# EAGLE design power_board_final_revisions (EAGLE 5.10)

## Sheet 1 of 5
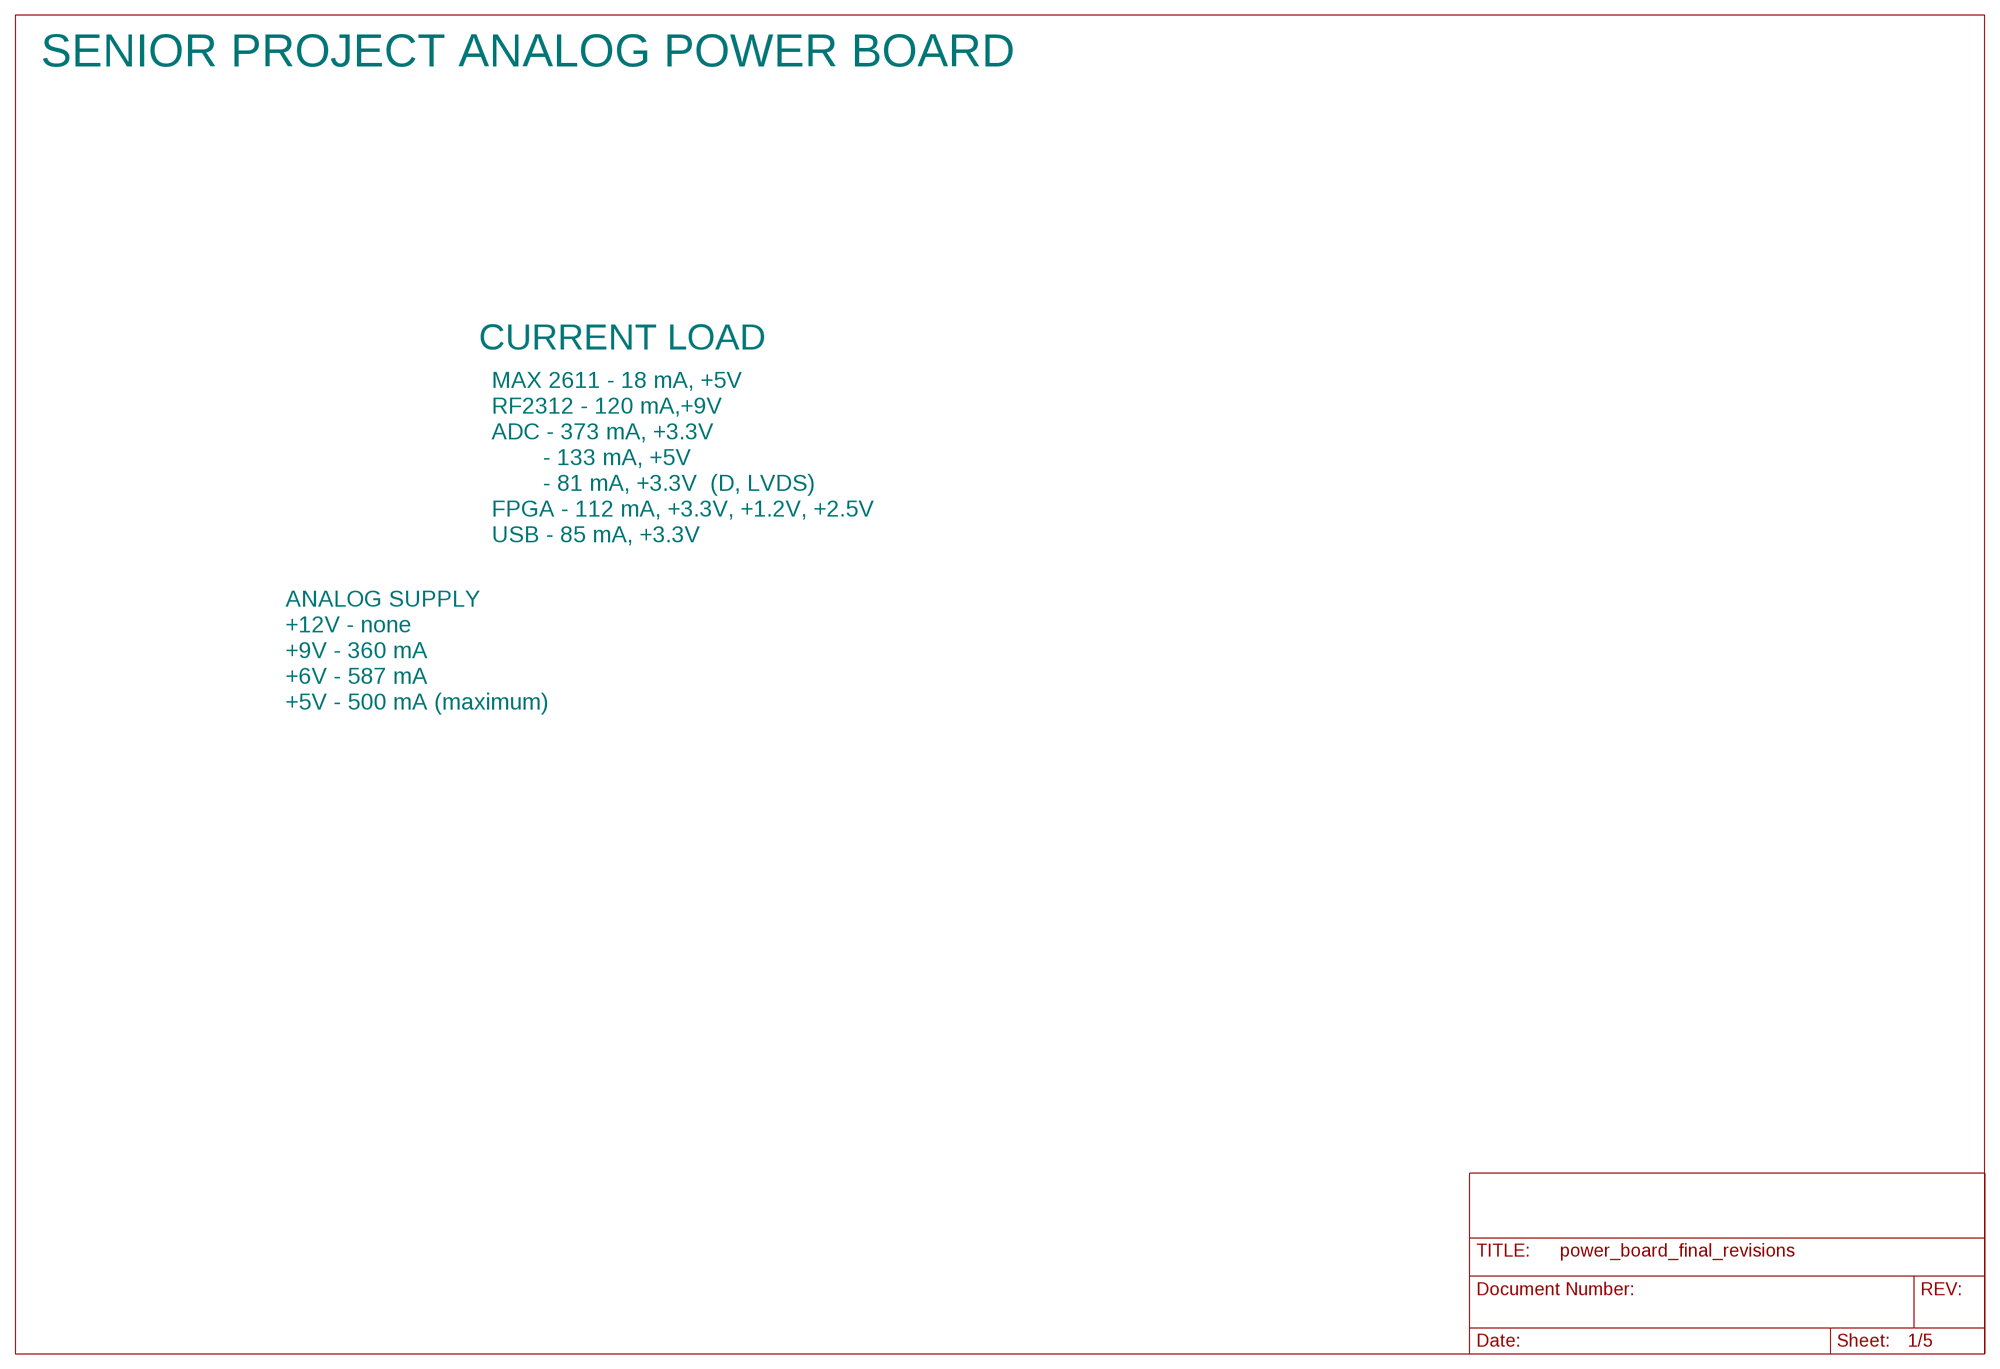
[diagram p0: schematic, sheet 1]

### Notes on the sheet
- SENIOR PROJECT ANALOG POWER BOARD
- CURRENT LOAD
- MAX 2611 - 18 mA, +5V
- RF2312 - 120 mA,+9V
- ADC - 373 mA, +3.3V
- - 133 mA, +5V
- - 81 mA, +3.3V  (D, LVDS)
- FPGA - 112 mA, +3.3V, +1.2V, +2.5V
- USB - 85 mA, +3.3V
- ANALOG SUPPLY
- +12V - none
- +9V - 360 mA
- +6V - 587 mA
- +5V - 500 mA (maximum)

## Sheet 2 of 5
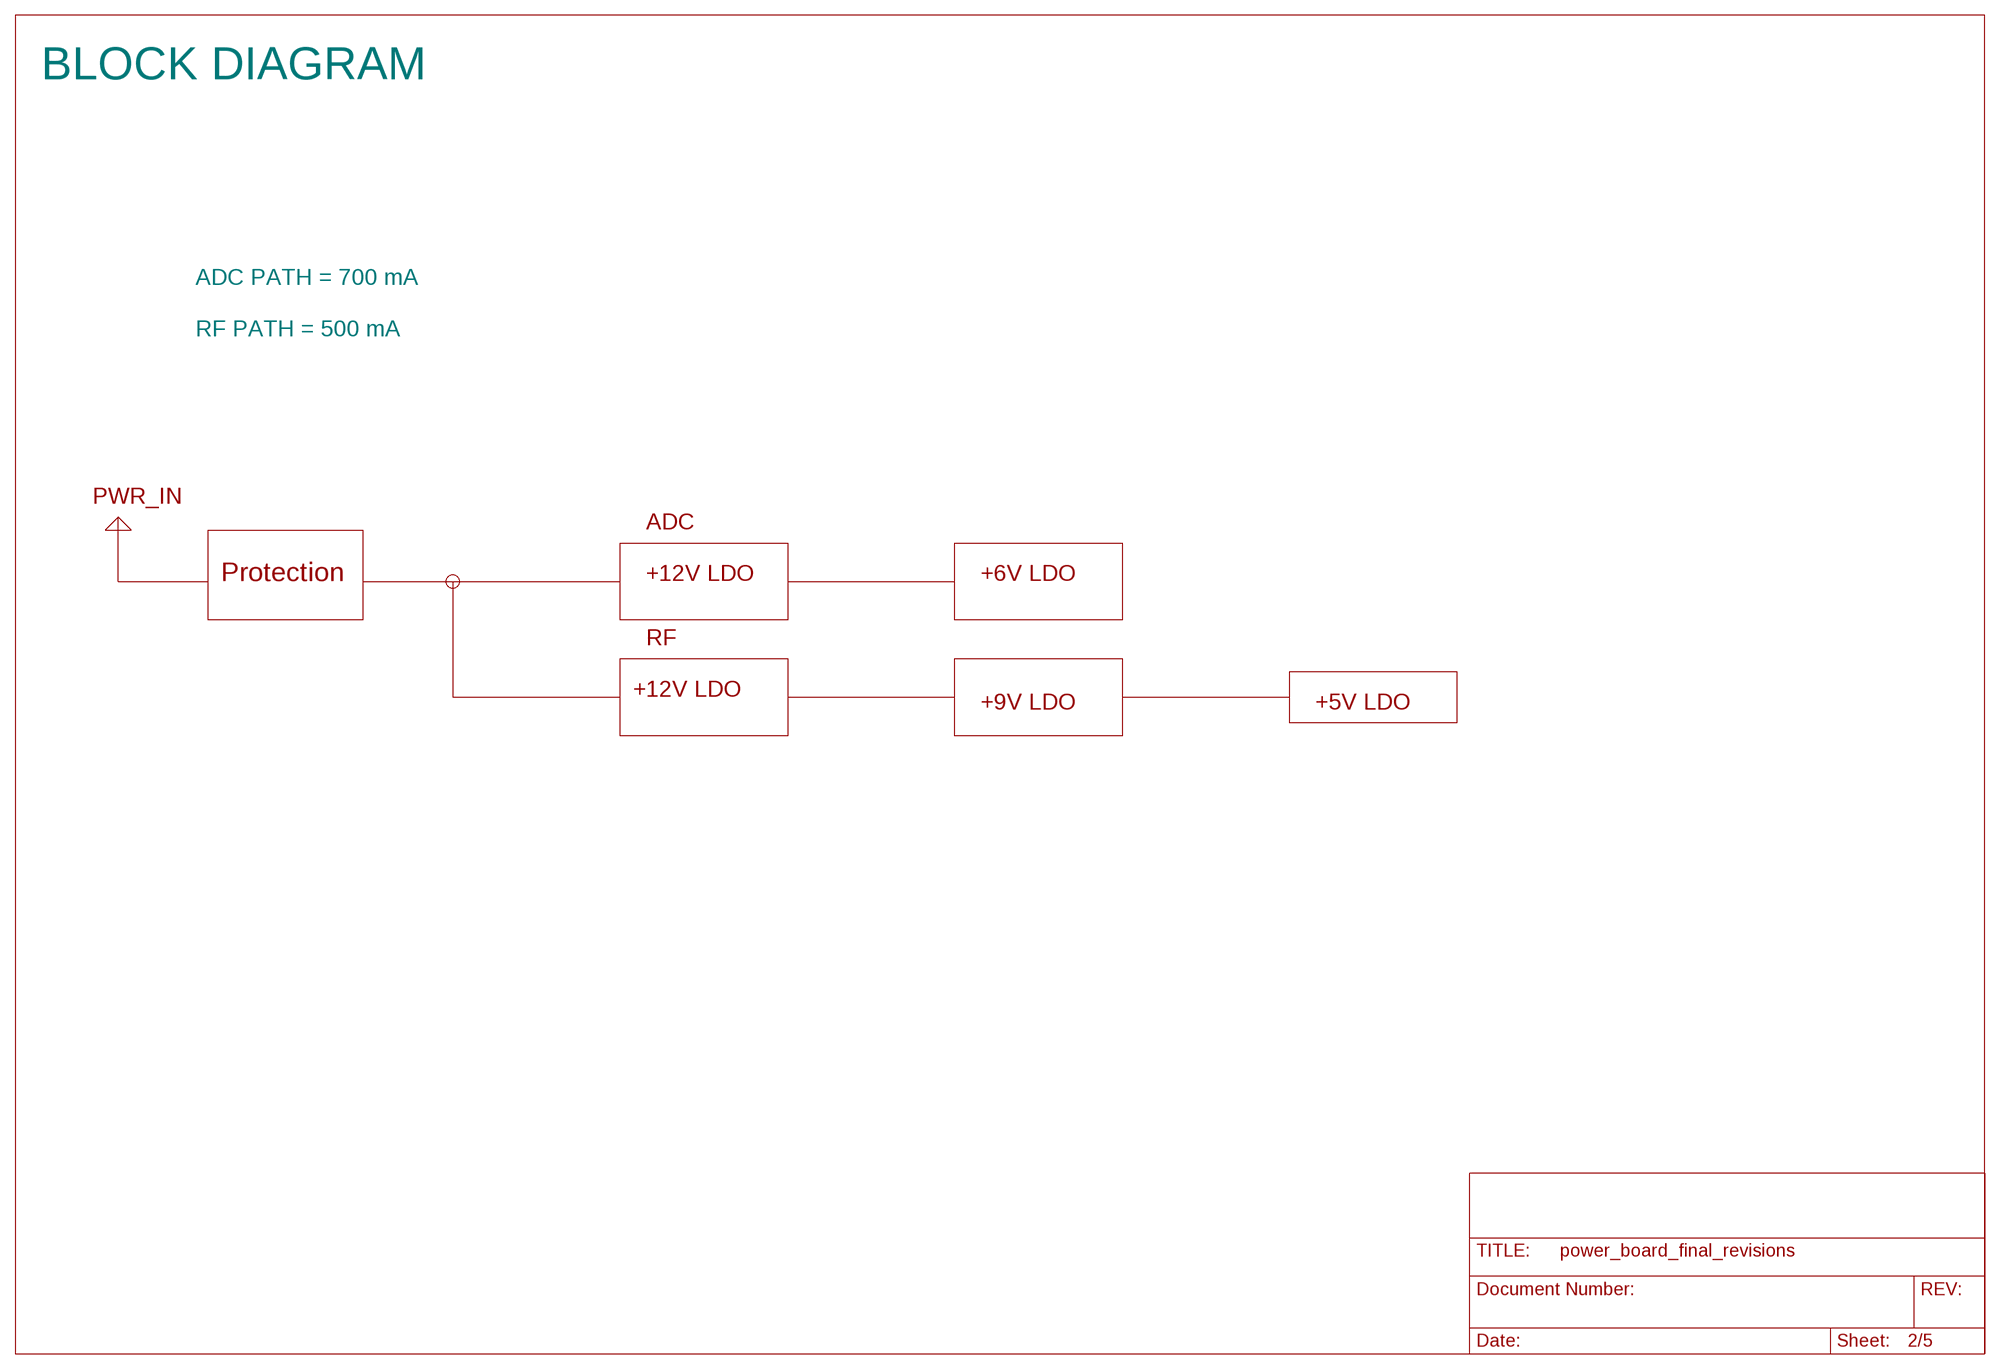
[diagram p1: schematic, sheet 2]

### Notes on the sheet
- BLOCK DIAGRAM
- ADC PATH = 700 mA
- RF PATH = 500 mA
- PWR_IN
- ADC
- Protection | +12V LDO | +6V LDO
- RF
- +12V LDO
- +9V LDO | +5V LDO

## Sheet 3 of 5
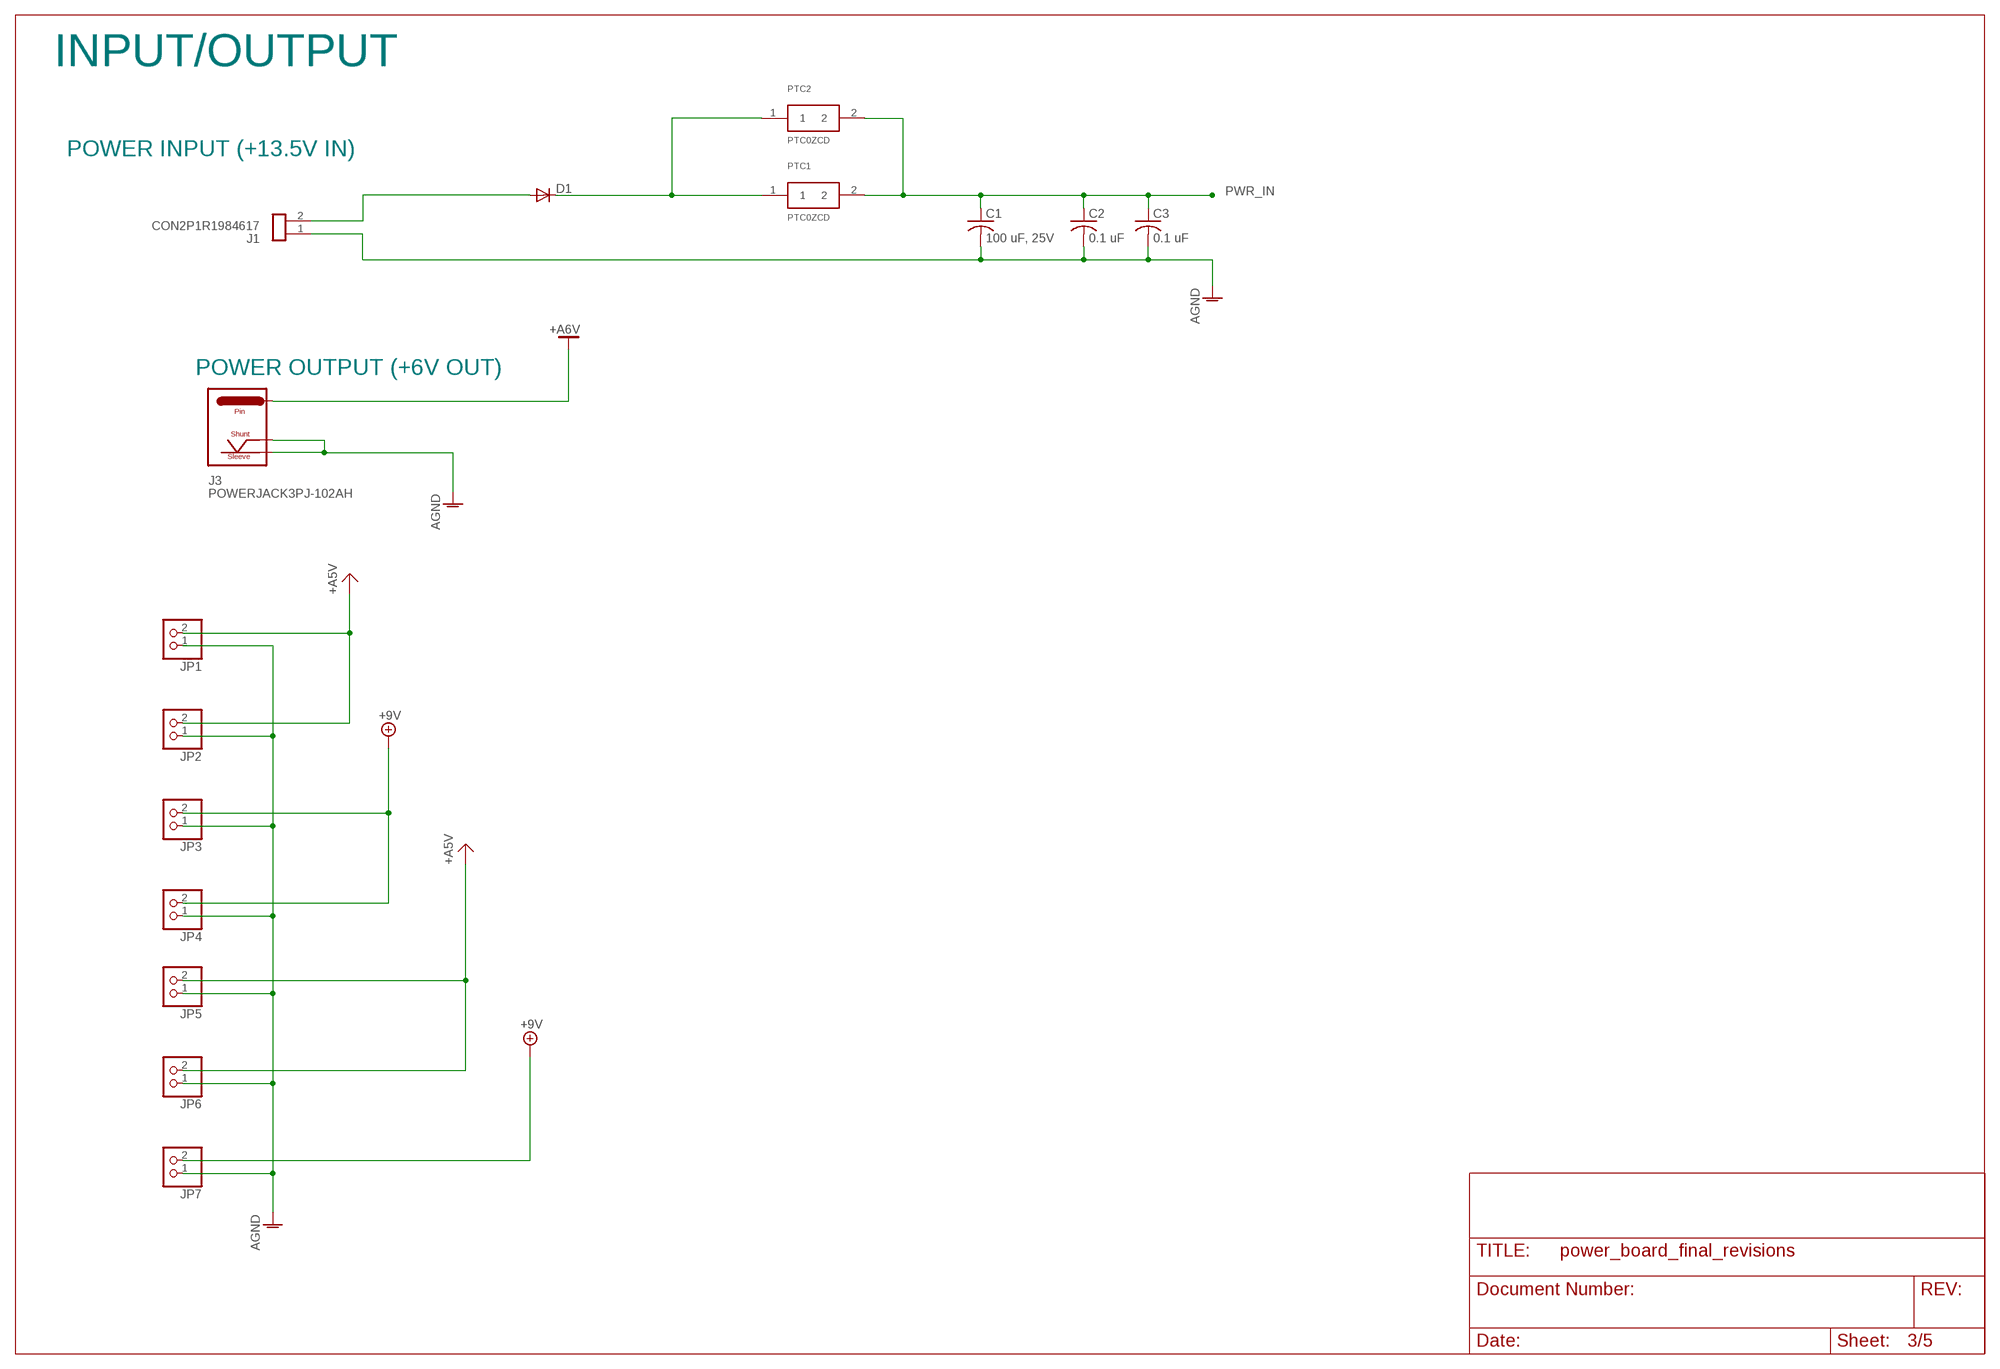
[diagram p2: schematic, sheet 3]

### Parts
C1  100 uF, 25V  C-USC1206  [C1206]
C2  0.1 uF  C-USC0805  [C0805]
C3  0.1 uF  C-USC0805  [C0805]
D1  1N4148DO35-7  [DO35-7]
J1  CON2P1R1984617  [1984617]
J3  POWERJACK3PJ-102AH  [PJ-102AH]
JP1  PINHD-1X2  [1X02]
JP2  PINHD-1X2  [1X02]
JP3  PINHD-1X2  [1X02]
JP4  PINHD-1X2  [1X02]
JP5  PINHD-1X2  [1X02]
JP6  PINHD-1X2  [1X02]
JP7  PINHD-1X2  [1X02]
PTC1  PTC0ZCD  [PTC-2920]
PTC2  PTC0ZCD  [PTC-2920]

### Nets
+9V: JP3.2 JP4.2 JP7.2 ; also sheet 4
+A5V: JP1.2 JP2.2 JP5.2 JP6.2 ; also sheet 4
+A6V: J3.CENTER(PIN) ; also sheet 5
AGND: C1.2 C2.2 C3.2 J1.1 J3.SLEEVE J3.SWITCH(SHUNT) JP1.1 JP2.1 JP3.1 JP4.1 JP5.1 JP6.1 JP7.1 ; also sheet 4,5
N$22: D1.C PTC1.1 PTC2.1
N$23: D1.A J1.2
PWR_IN: C1.1 C2.1 C3.1 PTC1.2 PTC2.2 ; also sheet 4,5

### Notes on the sheet
- INPUT/OUTPUT
- POWER INPUT (+13.5V IN)
- POWER OUTPUT (+6V OUT)

## Sheet 4 of 5
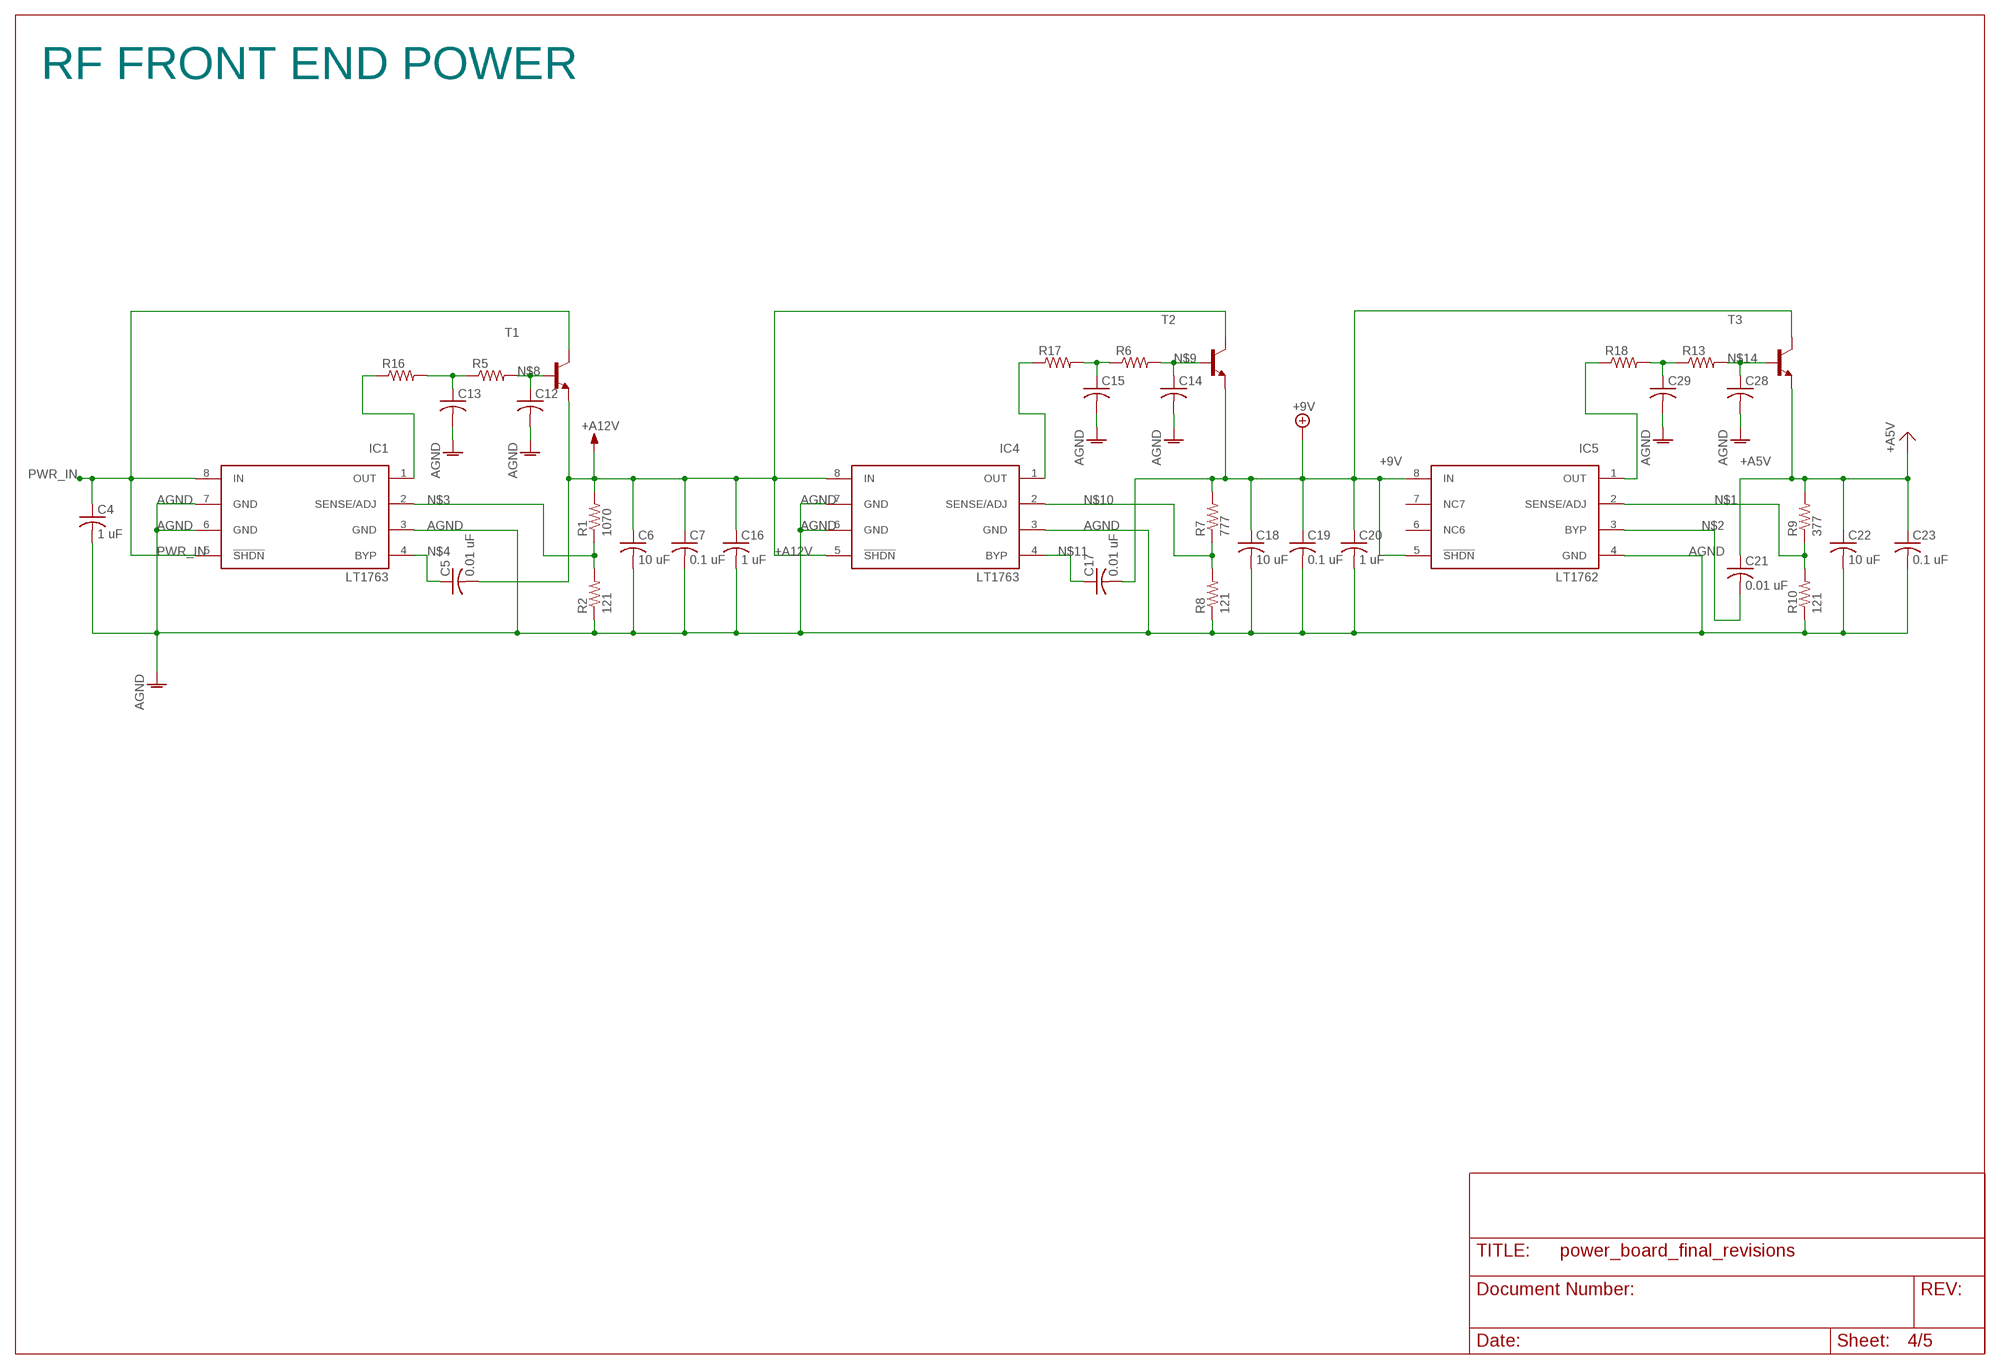
[diagram p3: schematic, sheet 4]

### Parts
C4  1 uF  C-USC0603  [C0603]
C5  0.01 uF  C-USC0603  [C0603]
C6  10 uF  C-USC0805  [C0805]
C7  0.1 uF  C-USC0805  [C0805]
C12  C-USC1206  [C1206]
C13  C-USC1206  [C1206]
C14  C-USC1206  [C1206]
C15  C-USC1206  [C1206]
C16  1 uF  C-USC0603  [C0603]
C17  0.01 uF  C-USC0603  [C0603]
C18  10 uF  C-USC0603  [C0603]
C19  0.1 uF  C-USC0805  [C0805]
C20  1 uF  C-USC0603  [C0603]
C21  0.01 uF  C-USC0603  [C0603]
C22  10 uF  C-USC0603  [C0603]
C23  0.1 uF  C-USC0805  [C0805]
C28  C-USC1206  [C1206]
C29  C-USC1206  [C1206]
IC1  LT1763  [SO-08]
IC4  LT1763  [SO-08]
IC5  LT1762  [MSOP08]
R1  1070  R-US_R0603  [R0603]
R2  121  R-US_R0603  [R0603]
R5  R-US_R0603  [R0603]
R6  R-US_R0603  [R0603]
R7  777  R-US_R0603  [R0603]
R8  121  R-US_R0603  [R0603]
R9  377  R-US_R0603  [R0603]
R10  121  R-US_R0603  [R0603]
R13  R-US_R0603  [R0603]
R16  R-US_R0603  [R0603]
R17  R-US_R0603  [R0603]
R18  R-US_R0603  [R0603]
T1  -NPN-SOT223  [SOT223]
T2  -NPN-SOT223  [SOT223]
T3  -NPN-SOT223  [SOT223]

### Nets
+9V: C17.2 C18.1 C19.1 C20.1 IC5.5(!SHDN) IC5.8(IN) R7.2 T2.3(E) T3.4(C) ; also sheet 3
+A5V: C21.1 C22.1 C23.1 R9.2 T3.3(E) ; also sheet 3
+A12V: C5.2 C6.1 C7.1 C16.1 IC4.5(!SHDN) IC4.8(IN) R1.2 T1.3(E) T2.4(C)
AGND: C4.2 C6.2 C7.2 C12.2 C13.2 C14.2 C15.2 C16.2 C18.2 C19.2 C20.2 C22.2 C23.2 C28.2 C29.2 IC1.3(GND) IC1.6(GND) IC1.7(GND) IC4.3(GND) IC4.6(GND) IC4.7(GND) IC5.4(GND) R2.1 R8.1 R10.1 ; also sheet 3,5
N$1: IC5.2(SENSE/ADJ) R9.1 R10.2
N$2: C21.2 IC5.3(BYP)
N$3: IC1.2(SENSE/ADJ) R1.1 R2.2
N$4: C5.1 IC1.4(BYP)
N$6: C13.1 R5.1 R16.2
N$8: C12.1 R5.2 T1.1(B)
N$9: C14.1 R6.2 T2.1(B)
N$10: IC4.2(SENSE/ADJ) R7.1 R8.2
N$11: C17.1 IC4.4(BYP)
N$12: C15.1 R6.1 R17.2
N$13: C29.1 R13.1 R18.2
N$14: C28.1 R13.2 T3.1(B)
N$19: IC5.1(OUT) R18.1
N$20: IC1.1(OUT) R16.1
N$21: IC4.1(OUT) R17.1
PWR_IN: C4.1 IC1.5(!SHDN) IC1.8(IN) T1.4(C) ; also sheet 3,5
Unconnected: IC5.6(NC6) IC5.7(NC7)

### Notes on the sheet
- RF FRONT END POWER

## Sheet 5 of 5
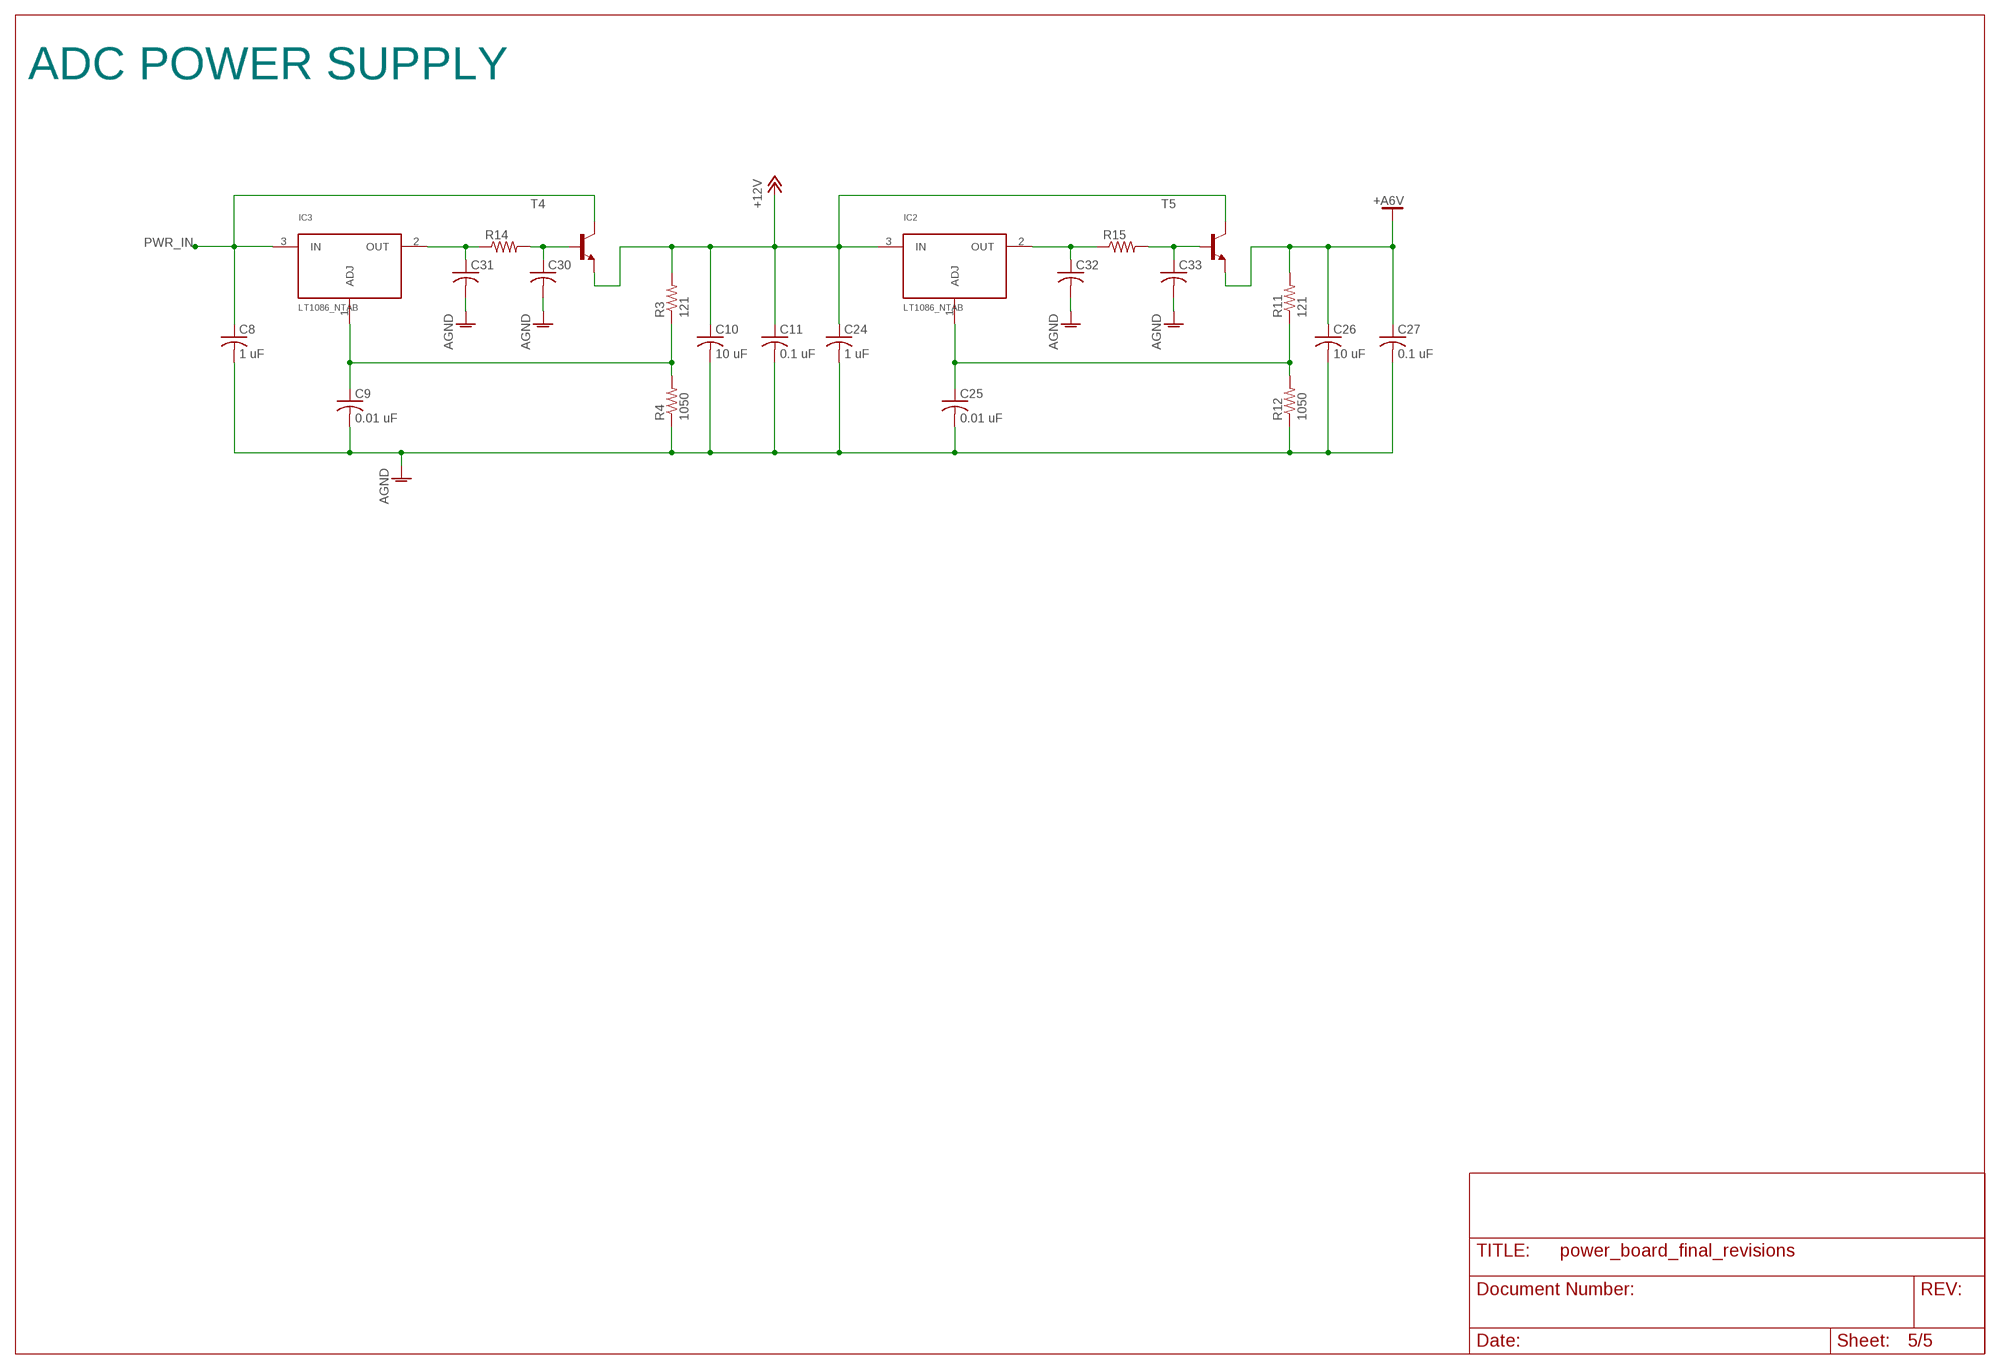
[diagram p4: schematic, sheet 5]

### Parts
C8  1 uF  C-USC0603  [C0603]
C9  0.01 uF  C-USC0603  [C0603]
C10  10 uF  C-USC0805  [C0805]
C11  0.1 uF  C-USC0603  [C0603]
C24  1 uF  C-USC0603  [C0603]
C25  0.01 uF  C-USC0603  [C0603]
C26  10 uF  C-USC0805  [C0805]
C27  0.1 uF  C-USC0603  [C0603]
C30  C-USC0805  [C0805]
C31  C-USC0805  [C0805]
C32  C-USC0805  [C0805]
C33  C-USC0805  [C0805]
IC2  LT1086_NTAB  LT1086_NTABV  [TO220V]
IC3  LT1086_NTAB  LT1086_NTABV  [TO220V]
R3  121  R-US_R0603  [R0603]
R4  1050  R-US_R0603  [R0603]
R11  121  R-US_R0603  [R0603]
R12  1050  R-US_R0603  [R0603]
R14  R-US_R0603  [R0603]
R15  R-US_R0603  [R0603]
T4  -NPN-SOT223  [SOT223]
T5  -NPN-SOT223  [SOT223]

### Nets
+12V: C10.1 C11.1 C24.1 IC2.3(IN) R3.2 T4.3(E) T5.4(C)
+A6V: C26.1 C27.1 R11.2 T5.3(E) ; also sheet 3
AGND: C8.2 C9.2 C10.2 C11.2 C24.2 C25.2 C26.2 C27.2 C30.2 C31.2 C32.2 C33.2 R4.1 R12.1 ; also sheet 3,4
N$5: C25.1 IC2.1(ADJ) R11.1 R12.2
N$7: C9.1 IC3.1(ADJ) R3.1 R4.2
N$15: C31.1 IC3.2(OUT) R14.1
N$16: C30.1 R14.2 T4.1(B)
N$17: C32.1 IC2.2(OUT) R15.1
N$18: C33.1 R15.2 T5.1(B)
PWR_IN: C8.1 IC3.3(IN) T4.4(C) ; also sheet 3,4

### Notes on the sheet
- ADC POWER SUPPLY

## Library data of the parts
C1-C29 = rcl:C-US: CAPACITOR, American symbol
C30-C33 = resistor:C-US: CAPACITOR, American symbol
D1 = diode:1N4148: DIODE high speed (Philips)
IC1 IC4 = senior_project_lib:LT1763
IC2 IC3 = senior_project_lib:LT1086_NTAB
IC5 = senior_project_lib:LT1762
J1 = ads4:CON2P1R: 2-Pin Single Row Header Strip
J3 = ads4:POWERJACK3: Pin-Sleeve-Shunt Power Jack
JP1-JP7 = pinhead:PINHD-1X2: PIN HEADER
PTC1 PTC2 = senior_project_lib:PTC
R1-R13 R16-R18 = rcl:R-US_: RESISTOR, American symbol
R14 R15 = resistor:R-US_: RESISTOR, American symbol
T1-T5 = transistor-neu-to92:*-NPN-: NPN Transistror

## Board
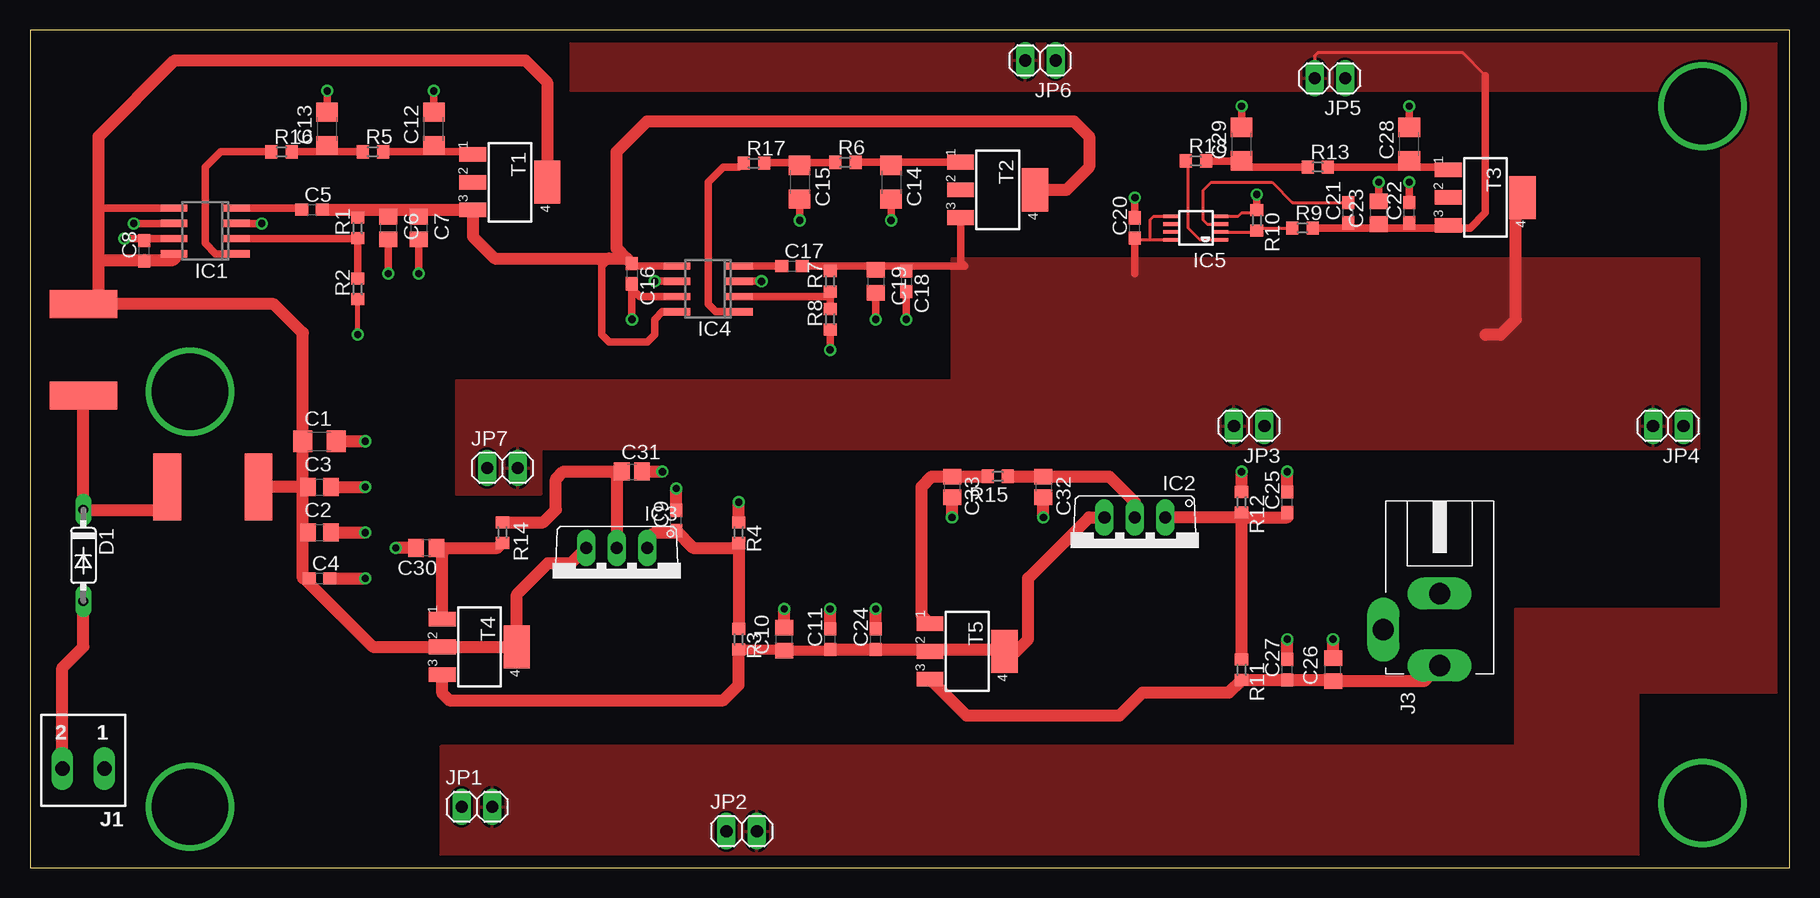
[diagram p5: board, top side]
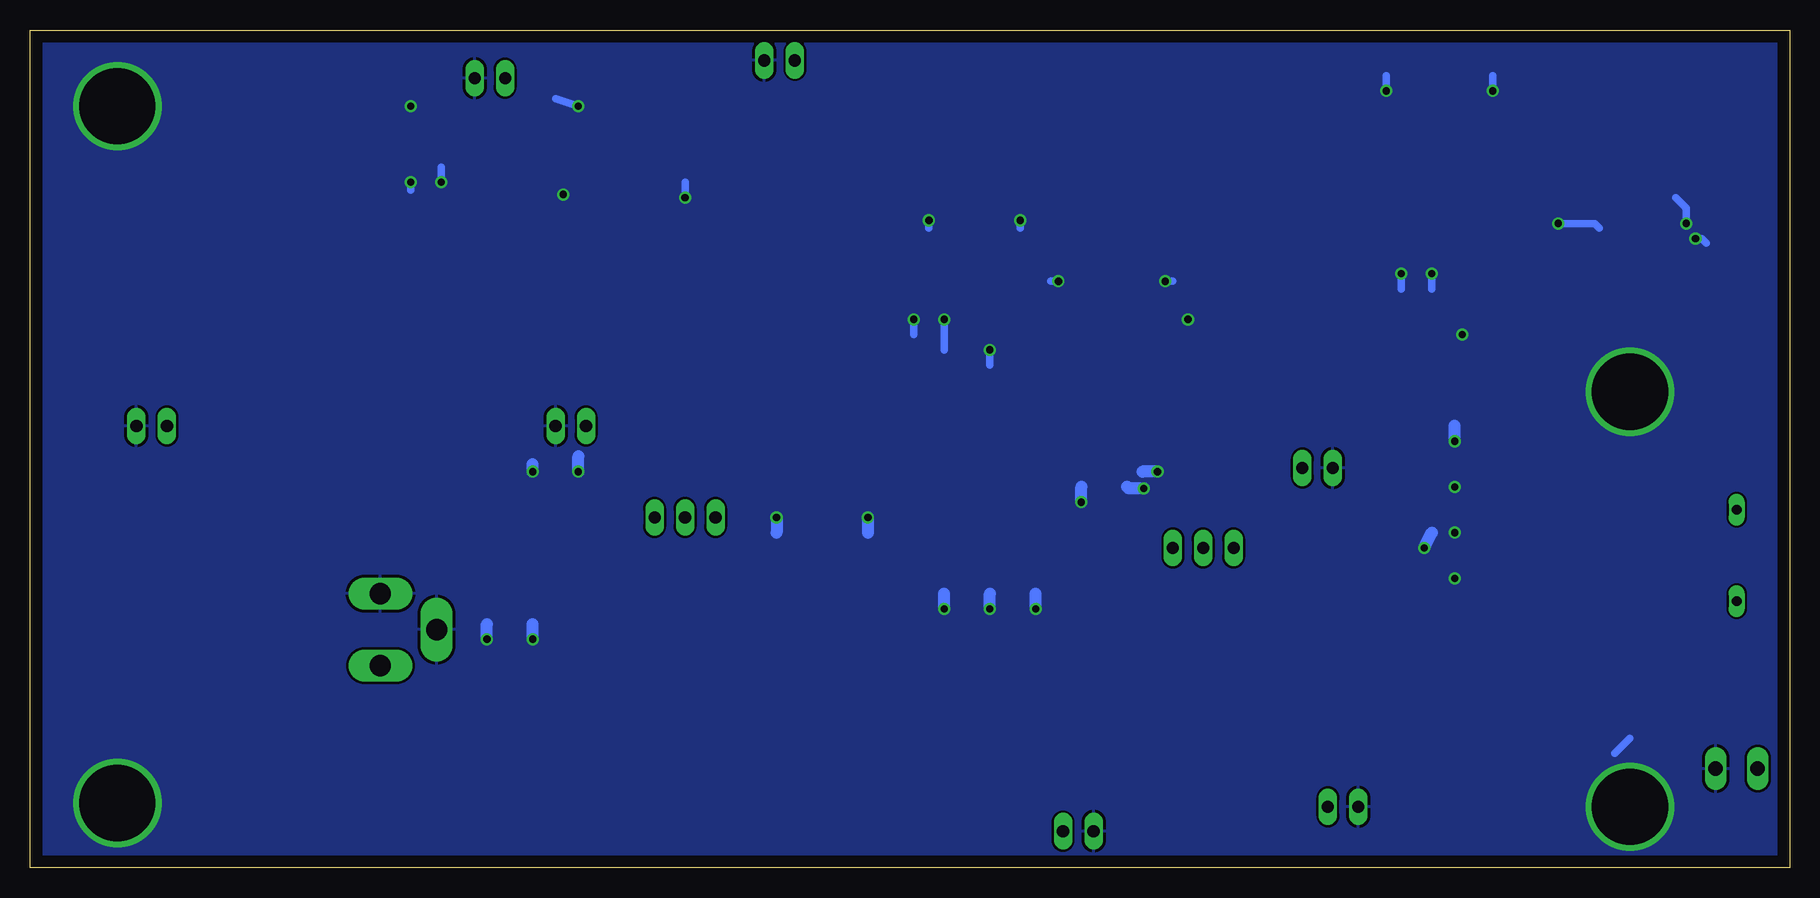
[diagram p6: board, bottom side, seen from below]

Size 146.66 x 69.85 mm. Coordinates in mm from the lower left corner, seen from the top.
Outline: 0,0 146.66,0 146.66,69.85 0,69.85 0,0
Copper layers (1*16): Top 0.035mm / dielectric 1.5mm / Bottom 0.035mm
Design rules "default": minimum track width 10mil, minimum drill 24mil, track to track 8mil, track to pad 8mil, pad to pad 8mil, via to via 8mil, smd to smd 8mil, copper to edge 40mil, drill to drill 8mil, minimum pad ring 10mil, minimum via ring 8mil, stop-mask expansion 4mil, vias tented up to drill 0mil, thermal gap 10mil

### Footprints (pad centres in the part's own frame; a part is rotated, then mirrored left to right if it is on the bottom)
C1206 = smd 1.6 x 1.8: 1 -1.4,0; 2 1.4,0
C0805 = smd 1.3 x 1.5: 1 -0.95,0; 2 0.95,0
C0603 = smd 1.1 x 1: 1 -0.85,0; 2 0.85,0
C0805' = smd 1.3 x 1.5: 1 -0.85,0; 2 0.85,0
DO35-7 = drill 0.813 long: A 3.81,0; C -3.81,0
SO-08 = smd 0.6 x 2.2: 1 -1.905,-2.6; 2 -0.635,-2.6; 3 0.635,-2.6; 4 1.905,-2.6; 5 1.905,2.6; 6 0.635,2.6; 7 -0.635,2.6; 8 -1.905,2.6
TO220V = drill 1.016 long: 1 -2.54,-2.54; 2 0,-2.54; 3 2.54,-2.54
MSOP08 = smd 0.3 x 1.2: 1 -0.976,-2.113; 2 -0.326,-2.113; 3 0.324,-2.113; 4 0.974,-2.113; 5 0.974,2.112; 6 0.324,2.112; 7 -0.326,2.112; 8 -0.976,2.112
1984617 = drill 1.2 long: 1 -1.75,0; 2 1.75,0
PJ-102AH = drill 1.778 long: CENTER -6,0; SLEEVE 0,0; SWITCH -3,4.7
1X02 = drill 1.016 long: 1 -1.27,0; 2 1.27,0
PTC-2920 = smd 2.311 x 5.613: 1 -3.81,0; 2 3.81,0
R0603 = smd 1 x 1.1: 1 -0.85,0; 2 0.85,0
SOT223 = smd 1.219 x 2.235: 1 -2.311,-3.099; 2 0,-3.099; 3 2.311,-3.099 | smd 3.6 x 2.2: 4 0,3.099

### Placement (x,y rotation side)
C1  24.13,35.56 0 top
C2  24.13,27.94 0 top
C3  24.13,31.75 0 top
C4  24.13,24.13 0 top
C5  23.49,54.86 0 top
C6  29.84,53.34 270 top
C7  32.38,53.34 270 top
C8  9.52,51.44 90 top
C9  53.85,28.96 90 top
C10  62.86,19.05 90 top
C11  66.67,19.05 90 top
C12  33.66,61.59 90 top
C13  24.77,61.59 90 top
C14  71.75,57.15 270 top
C15  64.14,57.15 270 top
C16  50.17,49.53 270 top
C17  63.5,50.16 0 top
C18  73.03,48.9 270 top
C19  70.48,48.9 270 top
C20  92.08,53.34 90 top
C21  109.86,54.61 90 top
C22  114.94,54.61 90 top
C23  112.4,54.61 90 top
C24  70.48,19.05 90 top
C25  104.78,30.48 90 top
C26  108.58,16.51 90 top
C27  104.78,16.51 90 top
C28  114.94,60.33 90 top
C29  100.97,60.33 90 top
C30  [C0805']  33.02,26.67 180 top
C31  [C0805']  50.17,33.02 0 top
C32  [C0805']  84.45,31.75 270 top
C33  [C0805']  76.83,31.75 270 top
D1  4.45,26.04 270 top
IC1  14.61,53.09 90 top
IC2  92.08,26.67 180 top
IC3  48.89,24.13 180 top
IC4  56.52,48.26 90 top
IC5  97.16,53.34 90 top
J1  4.45,8.26 180 top
J3  117.47,22.86 90 top
JP1  37.25,5.08 0 top
JP2  59.31,3.05 0 top
JP3  101.6,36.83 180 top
JP4  136.53,36.83 180 top
JP5  108.33,65.83 180 top
JP6  84.2,67.31 180 top
JP7  39.37,33.34 0 top
PTC1  15.24,31.75 0 top
PTC2  4.45,43.18 90 top
R1  27.3,53.34 90 top
R2  27.3,48.26 90 top
R3  59.06,19.05 270 top
R4  59.06,27.94 270 top
R5  28.58,59.69 0 top
R6  67.94,58.8 0 top
R7  66.67,48.9 90 top
R8  66.67,45.72 90 top
R9  106.05,53.34 0 top
R10  102.23,53.98 270 top
R11  100.97,16.51 270 top
R12  100.97,30.48 270 top
R13  107.31,58.42 0 top
R14  39.37,27.94 270 top
R15  80.64,32.64 180 top
R16  20.95,59.69 0 top
R17  60.33,58.74 0 top
R18  97.16,58.93 0 top
T1  40.01,57.15 270 top
T2  80.64,56.52 270 top
T3  121.28,55.88 270 top
T4  37.47,18.41 270 top
T5  78.11,18.03 270 top

### Tracks (layer width: path | path; a pad name or v marks a point on that pad's centre or on a via)
+9V
  Top 0.254: 93.34,52.36 92.2,52.36 C20.1 | 93.34,52.36 IC5.8 | IC5.5 93.64,54.31 93.34,54.02 93.34,52.36
  Top 0.61: C17.2 66.67,50.16 | 66.67,50.16 70.48,50.16 | 70.48,50.16 73.03,50.16 | 73.03,50.16 77.89,50.16 77.55,50.51 T2.3 | 66.67,50.16 R7.2 | 70.48,50.16 C19.1 | 73.03,50.16 C18.1 | 92.08,49.53 C20.1
  Top 1.016: T3.4 123.82,55.32 123.82,45.72 122.56,44.45 121.28,44.45
  pour Top: 76.83,50.8 139.06,50.8 139.06,34.92 42.55,34.92 42.55,31.11 35.56,31.11 35.56,40.64 76.83,40.64
+12V
  Top 0.813: C11.1 66.58,18.1 C10.1 62.77,18.2 R3.2
  Top 1.016: T4.3 34.37,14.53 34.92,13.97 57.78,13.97 59.06,15.24 R3.2 | C11.1 C24.1 81.75,18.2 81.92,18.03 | 81.92,18.03 T5.4 | 81.92,18.03 82.17,18.03 83.19,19.05 83.19,24.13 88.27,29.21 IC2.3
+A5V
  Top 0.254: 109.86,53.34 C21.1 | 112.4,53.34 C23.1 | JP5.2 107.06,67.69 107.31,67.94 119.38,67.94 121.28,66.04
  Top 0.61: T3.3 117.7,53.57 117.47,53.34 115.35,53.34 C22.1 114.94,53.34 112.4,53.34 109.86,53.34 R9.2 120.01,53.34 121.28,54.61 121.28,66.04
  pour Top: 45.09,72.39 146.69,72.39 146.69,16.51 146.69,14.61 133.99,14.61 133.99,0 34.29,0 34.29,10.16 123.82,10.16 123.82,21.59 140.97,21.59 140.97,64.77 45.09,64.77
+A6V
  Top 0.813: 108.48,15.66 C26.1 | 116.18,15.56 116.28,15.66
  Top 1.016: T5.3 78.03,12.7 90.81,12.7 92.71,14.61 99.91,14.61 R11.2 C27.1 108.48,15.66 | 116.28,15.66 J3.CENTER | C26.1 116.18,15.56
+A12V
  Top 0.254: 27.3,54.86 R1.2
  Top 0.61: C7.1 32.38,54.61 | IC4.5 50.38,50.16 C16.1 | IC4.8 52.7,46.35 52.07,45.72 52.07,44.45 51.44,43.81 48.26,43.81 47.62,44.45 47.62,50.16 48.26,50.8
  Top 1.016: C5.2 27.3,54.86 29.84,54.86 | 29.84,54.86 32.38,54.86 | 32.38,54.86 C7.1 | 29.84,54.86 C6.1 | 32.38,54.86 36.88,54.86 T1.3 36.91,52.63 38.73,50.8 48.26,50.8 49.75,50.8 | T2.4 86.36,56.52 88.27,58.42 88.27,60.96 87,62.23 51.44,62.23 48.89,59.69 48.89,51.65 49.75,50.8 | 49.75,50.8 C16.1
AGND  (via drill 0.6, 6.35)
  Top 0.254: IC5.4 100.67,54.31 100.97,54.61 102.02,54.61 R10.1
  Top 0.406: v27.3,44.45 R2.1
  Top 0.61: 29.95,52.39 C6.2 v29.84,49.53 | v32.38,49.53 C7.2 | C13.2 v24.77,64.77 | C12.2 v33.66,64.77 | IC4.7 50.8,47.62 50.17,48.26 | 50.17,48.26 C16.2 | v19.3,53.72 IC1.3 | v8.64,53.72 IC1.6 | v7.87,52.45 9.52,52.45 | 9.52,52.45 IC1.7 | v50.17,45.72 50.17,48.26 | C15.2 v64.14,53.98 | C14.2 v71.75,53.98 | v70.48,45.72 C19.2 | v73.03,45.72 C18.2 | v66.67,43.18 R8.1 | 9.52,52.45 C8.2 | C20.2 v92.08,55.88 | R10.1 v102.23,56.13 | C29.2 v100.97,63.5 | C28.2 v114.94,63.5 | C23.2 v112.4,57.15 | IC4.3 v60.96,48.9 | v52.07,48.9 IC4.6 | C22.2 v114.94,57.15
  Top 1.016: C1.2 v27.94,35.56 | C3.2 v27.94,31.75 | C2.2 v27.94,27.94 | C4.2 v27.94,24.13 | R12.1 v100.97,33.02 | C25.2 v104.78,33.02 | C31.2 v52.7,33.02 | R4.1 v59.06,30.48 | C9.2 v53.85,31.62 | C27.2 v104.78,19.05 | C26.2 v108.58,19.05 | C10.2 v62.86,21.59 | C11.2 v66.67,21.59 | C24.2 v70.48,21.59 | v76.83,29.21 C33.2 | v84.45,29.21 C32.2 | C30.2 v30.48,26.67
  Bottom 0.61: v29.84,49.53 29.84,48.26 | v32.38,49.53 32.38,48.26 | v24.77,64.77 24.77,66.04 | v33.66,64.77 33.66,66.04 | v19.3,53.72 16.26,53.72 15.88,53.34 | v8.64,53.72 8.64,54.99 9.52,55.88 | v7.87,52.45 7.37,52.45 6.98,52.07 | v64.14,53.98 64.14,53.34 | v71.75,53.98 71.75,53.34 | 70.48,43.18 v70.48,45.72 | 73.03,44.45 v73.03,45.72 | 66.67,41.91 v66.67,43.18 | v92.08,55.88 92.08,57.15 | v100.97,63.5 102.87,64.14 | 14.61,9.53 13.34,10.79 | v112.4,57.15 112.4,58.42 | v60.96,48.9 61.59,48.9 | v52.07,48.9 51.44,48.9 | v114.94,57.15 114.94,56.52
  Bottom 1.016: v27.94,35.56 27.94,36.83 | v100.97,33.02 100.97,34.29 | v104.78,33.02 104.78,33.66 | v30.48,26.67 29.84,27.94 | v52.7,33.02 53.97,33.02 | v59.06,30.48 59.06,31.75 | v53.85,31.62 55.12,31.62 55.25,31.75 | v104.78,19.05 104.78,20.32 | v108.58,19.05 108.58,20.32 | v62.86,21.59 62.86,22.86 | v66.67,21.59 66.67,22.86 | v70.48,21.59 70.48,22.86 | v76.83,29.21 76.83,27.94 | v84.45,29.21 84.45,27.94
  other vias: 13.34,5.08 13.34,39.69 139.38,63.5 139.38,5.4
  pour Bottom: 0,72.39 146.69,72.39 146.69,0 0,0
N$1
  Top 0.254: IC5.2 102.23,53.01 R10.2 102.45,53.34 R9.1
N$2
  Top 0.254: C21.2 105.19,55.46 103.5,57.15 98.42,57.15 97.79,56.52 97.79,53.98 98.1,53.66 IC5.3
N$3
  Top 0.406: 27.27,52.45 R1.1
  Top 0.61: IC1.2 27.27,52.45 | R1.1 R2.2
N$4
  Top 0.61: IC1.4 22.52,54.99 C5.1
N$5
  Top 1.016: R11.1 100.97,29.21 | C25.1 104.78,29.21 101.39,29.21 R12.2 100.97,29.21 | 100.97,29.21 IC2.1
N$6
  Top 0.61: R16.2 24.77,59.69 | 24.77,59.69 R5.1 | 24.77,59.69 C13.1
N$7
  Top 1.016: R3.1 R4.2 58.64,26.67 55.25,26.67 53.85,28.07 C9.1 53.68,27.94 52.07,27.94 51.44,27.3 IC3.1
N$8
  Top 0.61: 33.34,59.69 C12.1 33.66,59.69 | R5.2 33.66,59.69 | 33.66,59.69 36.68,59.69 T1.1
N$9
  Top 0.61: R6.2 68.92,58.83 71.75,58.83 | 71.75,58.83 T2.1 | 71.75,58.83 C14.1
N$10
  Top 0.61: R8.2 R7.1 66.29,47.66 66.29,47.62 IC4.2
N$11
  Top 0.61: IC4.4 C17.1
N$12
  Top 0.61: R17.2 61.34,58.8 64.14,58.8 | 64.14,58.8 R6.1 | 64.14,58.8 C15.1
N$13
  Top 0.61: R13.1 101.28,58.42 C29.1 98.11,58.92 R18.2 98.23,58.92
N$14
  Top 0.61: R13.2 113.98,58.42 | 113.98,58.42 C28.1 | T3.1 117.96,58.42 113.98,58.42
N$15
  Top 1.016: R14.1 42.76,28.79 43.81,29.84 43.81,32.38 44.45,33.02 C31.1 48.89,32.6 IC3.2
N$16
  Top 1.016: T4.1 34.37,26.17 C30.1 38.95,26.67 R14.2
N$17
  Top 1.016: R15.1 84.42,32.64 arc-90 C32.1 89.95,32.6 92.08,30.48 IC2.2
N$18
  Top 1.016: T5.1 74.3,21.06 74.3,31.75 75.14,32.6 C33.1 79.76,32.6 arc90 R15.2
N$19
  Top 0.254: IC5.1 97.5,52.36 96.52,53.34 96.52,58.71 R18.1
N$20
  Top 0.61: R16.1 15.88,59.69 14.61,58.42 14.61,52.07 15.49,51.18 IC1.1
N$21
  Top 0.61: R17.1 59.06,58.42 57.78,58.42 56.52,57.15 56.52,46.99 57.15,46.35 IC4.1
N$22
  Top 1.016: PTC2.1 D1.C 11.43,29.84 PTC1.1
N$23
  Top 1.016: J1.2 2.7,16.66 4.45,18.41 D1.A
PWR_IN
  Top 0.61: IC1.5 6.1,54.99 5.71,54.61 | 9.52,50.67 C8.1 | 12.07,50.8 12.07,51.12 IC1.8
  Top 1.016: C1.1 22.86,35.69 | 5.71,50.67 9.52,50.67 11.93,50.67 12.07,50.8 | T1.4 43.1,65.48 41.27,67.31 12.07,67.31 5.71,60.96 5.71,54.61 5.71,50.67 | 22.73,31.75 C1.1 | 22.73,27.94 22.73,31.75 | 22.73,24.26 22.73,27.94 | 22.73,24.26 22.73,24.13 C4.1 | 22.73,31.75 C3.1 | 22.73,27.94 C2.1 | 22.73,24.26 28.58,18.41 T4.4 40.56,22.78 43.18,25.4 45.09,25.4 IC3.3 | 22.73,31.75 PTC1.2 | 5.08,46.99 20.32,46.99 22.73,44.58 C1.1 | 5.08,46.99 PTC2.2 | 5.71,50.67 5.71,47.62 5.08,46.99

### Text on the board
SILKSCREEN: SENIOR PROJECT POWER BOARD